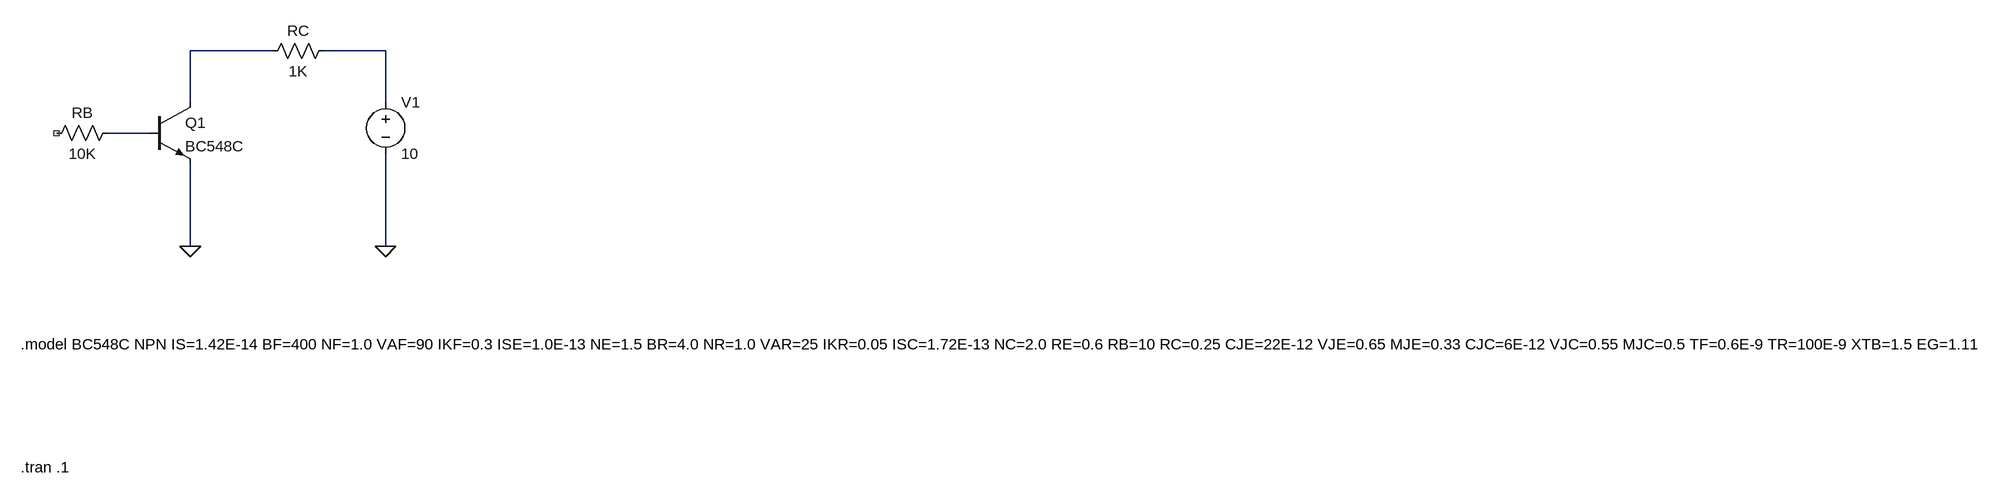
[diagram p0: schematic Transistor en corte (fig4).asc]
Transistor en corte (fig4).asc, the LTspice schematic file:
Version 4.1
SHEET 1 3208 728
WIRE 368 64 240 64
WIRE 544 64 448 64
WIRE 240 144 240 64
WIRE 544 144 544 64
WIRE 176 192 112 192
WIRE 240 368 240 240
WIRE 544 368 544 224
FLAG 544 368 0
FLAG 240 368 0
SYMBOL npn 176 144 R0
SYMATTR InstName Q1
SYMATTR Value BC548C
SYMBOL res 128 176 R90
WINDOW 0 0 56 VBottom 2
WINDOW 3 32 56 VTop 2
SYMATTR InstName RB
SYMATTR Value 10K
SYMBOL res 464 48 R90
WINDOW 0 0 56 VBottom 2
WINDOW 3 32 56 VTop 2
SYMATTR InstName RC
SYMATTR Value 1K
SYMBOL voltage 544 128 R0
WINDOW 123 0 0 Left 0
WINDOW 39 0 0 Left 0
SYMATTR InstName V1
SYMATTR Value 10
TEXT -24 520 Left 2 !.model BC548C NPN IS=1.42E-14 BF=400 NF=1.0 VAF=90 IKF=0.3 ISE=1.0E-13 NE=1.5 BR=4.0 NR=1.0 VAR=25 IKR=0.05 ISC=1.72E-13 NC=2.0 RE=0.6 RB=10 RC=0.25 CJE=22E-12 VJE=0.65 MJE=0.33 CJC=6E-12 VJC=0.55 MJC=0.5 TF=0.6E-9 TR=100E-9 XTB=1.5 EG=1.11
TEXT -24 712 Left 2 !.tran .1

The netlist it stands for:
* Transistor en corte (fig4).asc
Q1 N001 N003 0 0 BC548C
RB N003 NC_01 10K
RC N002 N001 1K
V1 N002 0 10
.model NPN NPN
.model PNP PNP
.lib standard.bjt
.model BC548C NPN IS=1.42E-14 BF=400 NF=1.0 VAF=90 IKF=0.3 ISE=1.0E-13 NE=1.5 BR=4.0 NR=1.0 VAR=25 IKR=0.05 ISC=1.72E-13 NC=2.0 RE=0.6 RB=10 RC=0.25 CJE=22E-12 VJE=0.65 MJE=0.33 CJC=6E-12 VJC=0.55 MJC=0.5 TF=0.6E-9 TR=100E-9 XTB=1.5 EG=1.11
.tran .1
.backanno
.end